# Altium schematic sheet Sheet_1.schdoc
size 253 x 180 mm
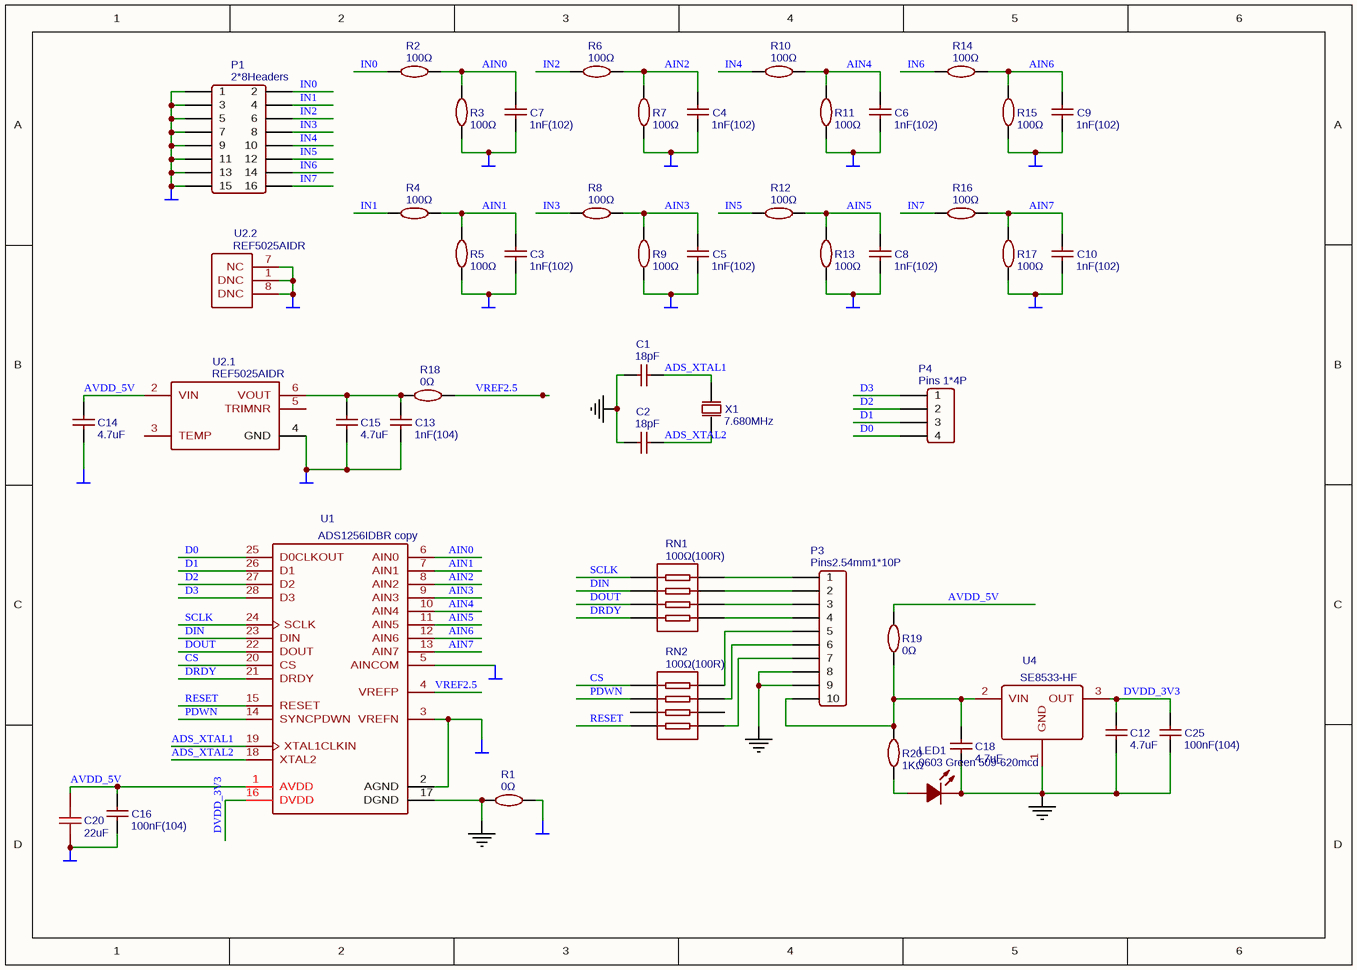
[diagram p0: Sheet_1.schdoc]

## Parts
C1  18pF  [0603]
C2  18pF  [0603]
C3  1nF(102)  [0603]
C4  1nF(102)  [0603]
C5  1nF(102)  [0603]
C6  1nF(102)  [0603]
C7  1nF(102)  [0603]
C8  1nF(102)  [0603]
C9  1nF(102)  [0603]
C10  1nF(102)  [0603]
C12  4.7uF  [0805]
C13  1nF(104)  [0805]
C14  4.7uF  [0805]
C15  4.7uF  [0805]
C16  100nF(104)  [0805]
C18  4.7uF  [0805]
C20  22uF  [0805]
C25  100nF(104)  [0805]
LED1  0603 Green 509-620mcd  [LED-0603]
P1  2*8Headers  [HDR-8X2/2.54]
P3  Pins2.54mm1*10P  [HDR-10X1/2.54]
P4  Pins 1*4P  [HDR-4X1/2.54]
R1  0Ω  [0603]
R2  100Ω  [0805]
R3  100Ω  [0805]
R4  100Ω  [0805]
R5  100Ω  [0805]
R6  100Ω  [0805]
R7  100Ω  [0805]
R8  100Ω  [0805]
R9  100Ω  [0805]
R10  100Ω  [0805]
R11  100Ω  [0805]
R12  100Ω  [0805]
R13  100Ω  [0805]
R14  100Ω  [0805]
R15  100Ω  [0805]
R16  100Ω  [0805]
R17  100Ω  [0805]
R18  0Ω  [0603]
R19  0Ω  [0603]
R20  1KΩ  [0603]
RN1  100Ω(100R)  [0603_X4]
RN2  100Ω(100R)  [0603_X4]
U1  ADS1256IDBR copy  [SSOP-28_208MIL]
U2.1  REF5025AIDR  [SOIC-8_150MIL]
U2.2  REF5025AIDR  [SOIC-8_150MIL]
U4  SE8533-HF  [SOT-89(SOT-89-3)]
X1  7.680MHz  [OSC-49S-1]

## Nets
AGND: C3.1 C4.1 C5.1 C6.1 C7.1 C8.1 C9.1 C10.1 C13.1 C14.1 C15.1 C16.1 C20.1 P1.1 P1.3 P1.5 P1.7 P1.9 P1.11 P1.13 P1.15 R1.2 R3.1 R5.1 R7.1 R9.1 R11.1 R13.1 R15.1 R17.1 U1.2(AGND) U1.3(VREFN) U1.5(AINCOM) U2.1.4(GND) U2.2.1(DNC) U2.2.7(NC) U2.2.8(DNC)
DGND: C1.1 C2.1 C12.1 C18.1 C25.1 LED1.2(K) P3.8 P3.9 R1.1 U1.17(DGND) U4.1(GND)
ADS_XTAL1: C1.2 U1.19(XTAL1CLKIN) X1.1(OSC1)
ADS_XTAL2: C2.2 U1.18(XTAL2) X1.2(OSC2)
AIN0: C7.2 R2.2 R3.2 U1.6(AIN0)
AIN1: C3.2 R4.2 R5.2 U1.7(AIN1)
AIN2: C4.2 R6.2 R7.2 U1.8(AIN2)
AIN3: C5.2 R8.2 R9.2 U1.9(AIN3)
AIN4: C6.2 R10.2 R11.2 U1.10(AIN4)
AIN5: C8.2 R12.2 R13.2 U1.11(AIN5)
AIN6: C9.2 R14.2 R15.2 U1.12(AIN6)
AIN7: C10.2 R16.2 R17.2 U1.13(AIN7)
AVDD_5V: C14.2 C16.2 C20.2 R19.2 U1.1(AVDD) U2.1.2(VIN)
CS: RN2.1 U1.20(CS)
D0: P4.4 U1.25(D0CLKOUT)
D1: P4.3 U1.26(D1)
D2: P4.2 U1.27(D2)
D3: P4.1 U1.28(D3)
DIN: RN1.2 U1.23(DIN)
DOUT: RN1.3 U1.22(DOUT)
DRDY: RN1.4 U1.21(DRDY)
DVDD_3V3: C12.2 C25.2 U1.16(DVDD) U4.3(OUT)
IN0: P1.2 R2.1
IN1: P1.4 R4.1
IN2: P1.6 R6.1
IN3: P1.8 R8.1
IN4: P1.10 R10.1
IN5: P1.12 R12.1
IN6: P1.14 R14.1
IN7: P1.16 R16.1
PDWN: RN2.2 U1.14(SYNCPDWN)
RESET: RN2.4 U1.15(RESET)
SCLK: RN1.1 U1.24(SCLK)
VREF2.5: R18.2 U1.4(VREFP)
NetC13_2: C13.2 C15.2 R18.1 U2.1.6(VOUT)
NetC18_2: C18.2 P3.10 R19.1 R20.2 U4.2(VIN)
NetLED1_1: LED1.1(A) R20.1
NetP3_1: P3.1 RN1.8
NetP3_2: P3.2 RN1.7
NetP3_3: P3.3 RN1.6
NetP3_4: P3.4 RN1.5
NetP3_5: P3.5 RN2.8
NetP3_6: P3.6 RN2.7
NetP3_7: P3.7 RN2.5

Not connected (* = marked no-connect by the designer): RN2 3 6; U2.1 3(TEMP) 5(TRIMNR)

## Library data of the parts
C1 C2 = (no symbol name): BOM_Manufacturer Part: CL10C180JB8NNNC; BOM_Manufacturer: SAMSUNG; nameAlias: Capacitance; BOM_Supplier: LCSC; BOM_LCSC: C1647; BOM_LCSC Assembly: Yes; spicePre: C; spiceSymbolName: CL10C180JB8NNNC
C3-C10 = (no symbol name): BOM_Manufacturer: VISHAY; BOM_Manufacturer Part: VJ0603Y102KXACW1BC; nameAlias: Value; Contributor: LCSC; BOM_Supplier: LCSC; BOM_LCSC: C153794; spicePre: C; spiceSymbolName: VJ0603Y102KXACW1BC
C12 C14 C15 C18 = (no symbol name): BOM_Manufacturer Part: CL21A475KOFNNNE; BOM_Manufacturer: SAMSUNG; nameAlias: Capacitance; BOM_Supplier: LCSC; BOM_LCSC: C1746; spicePre: C; spiceSymbolName: CL21A475KOFNNNE
C13 C16 C25 = (no symbol name): BOM_Manufacturer: AVX; BOM_Manufacturer Part: 08055C104JAT2A; nameAlias: Value; Contributor: LCSC; BOM_Supplier: LCSC; BOM_LCSC: C129175; spicePre: C; spiceSymbolName: 08055C104JAT2A
C20 = (no symbol name): BOM_Manufacturer: FH; BOM_Manufacturer Part: 0805X226M100NT; nameAlias: Capacitance; BOM_Supplier: LCSC; BOM_LCSC: C36255; spicePre: C; spiceSymbolName: 0805X226M100NT
LED1 = (no symbol name): BOM_Manufacturer: KENTO; BOM_Supplier: LCSC; BOM_Manufacturer Part: 0603 Green 509-620mcd; BOM_LCSC: C12624; spicePre: L
P1 = (no symbol name): BOM_Manufacturer: BOOMELE; BOM_Manufacturer Part: Double row straight 2*8Headers??Pins 2.54mm; BOM_Supplier: LCSC; BOM_LCSC: C68234; image: http://image.lceda.cn/szlcsc/C68234.jpg; spicePre: P
P3 = (no symbol name): BOM_Manufacturer: ReliaPro; BOM_Manufacturer Part: Headers??Pins2.54mm1*10P; BOM_Supplier: LCSC; image: http://image.lceda.cn/szlcsc/C57369.jpg; spicePre: P
P4 = (no symbol name): BOM_Manufacturer: ReliaPro; BOM_Manufacturer Part: Headers??Pins 1*4P; BOM_Supplier: LCSC; image: http://image.lceda.cn/szlcsc/C59481.jpg; spicePre: P
R1 R18 R19 = (no symbol name): BOM_Manufacturer: UniOhm; BOM_Manufacturer Part: 0603WAF0000T5E; nameAlias: Value; BOM_Supplier: LCSC; BOM_LCSC: C21189; BOM_LCSC Assembly: Yes; spicePre: R; spiceSymbolName: 0603WAF0000T5E
R2 R4 R6 R8 R10 R12 R14 R16 = (no symbol name): BOM_Manufacturer: UniOhm; BOM_Manufacturer Part: 0805W8F1000T5E; nameAlias: Value; BOM_Supplier: LCSC; BOM_LCSC: C17408; BOM_LCSC Assembly: Yes; spicePre: R; spiceSymbolName: 0805W8F1000T5E
R3 R5 R7 R9 R11 R13 R15 R17 = (no symbol name): BOM_Manufacturer: UniOhm; BOM_Manufacturer Part: 0805W8F1002T5E; nameAlias: Value; BOM_Supplier: LCSC; BOM_LCSC: C17414; BOM_LCSC Assembly: Yes; spicePre: R; spiceSymbolName: 0805W8F1002T5E
R20 = (no symbol name): BOM_Manufacturer: UniOhm; BOM_Manufacturer Part: 0603WAJ0102T5E; nameAlias: Value; BOM_Supplier: LCSC; BOM_LCSC: C25585; spicePre: R; spiceSymbolName: 0603WAJ0102T5E
RN1 RN2 = (no symbol name): BOM_Manufacturer: YAGEO; BOM_Manufacturer Part: YC164-FR-07100RL; nameAlias: Value; BOM_Supplier: LCSC; BOM_LCSC: C136838; spicePre: R; spiceSymbolName: YC164-FR-07100RL
U1 = (no symbol name): BOM_Manufacturer: TI; BOM_Supplier: LCSC; BOM_Manufacturer Part: ADS1256IDBR; BOM_LCSC: C28186; image: http://image.lceda.cn/szlcsc/C28186.jpg; spicePre: U
U2.1 = (no symbol name): BOM_Manufacturer: TI; subpart_no: 1; tags: Voltage Reference; BOM_Supplier: LCSC; BOM_Manufacturer Part: REF5025AIDR; BOM_LCSC: C11341; image: http://image.lceda.cn/szlcsc/C11341.jpg; spicePre: U
U2.2 = (no symbol name): BOM_Manufacturer: TI; subpart_no: 2; tags: Voltage Reference; BOM_Supplier: LCSC; BOM_Manufacturer Part: REF5025AIDR; BOM_LCSC: C11341; image: http://image.lceda.cn/szlcsc/C11341.jpg; spicePre: U
U4 = (no symbol name): BOM_Manufacturer: SEAWARD; BOM_Supplier: LCSC; BOM_Manufacturer Part: SE8533-HF; BOM_LCSC: C115013; spicePre: U
X1 = (no symbol name): BOM_Manufacturer: YXC; BOM_Manufacturer Part: X49SD8MSD2SC; nameAlias: Frequency; BOM_Supplier: LCSC; BOM_LCSC: C21263; spicePre: X; spiceSymbolName: X49SD8MSD2SC